# EAGLE design circuit_protection (EAGLE 6.5.0)
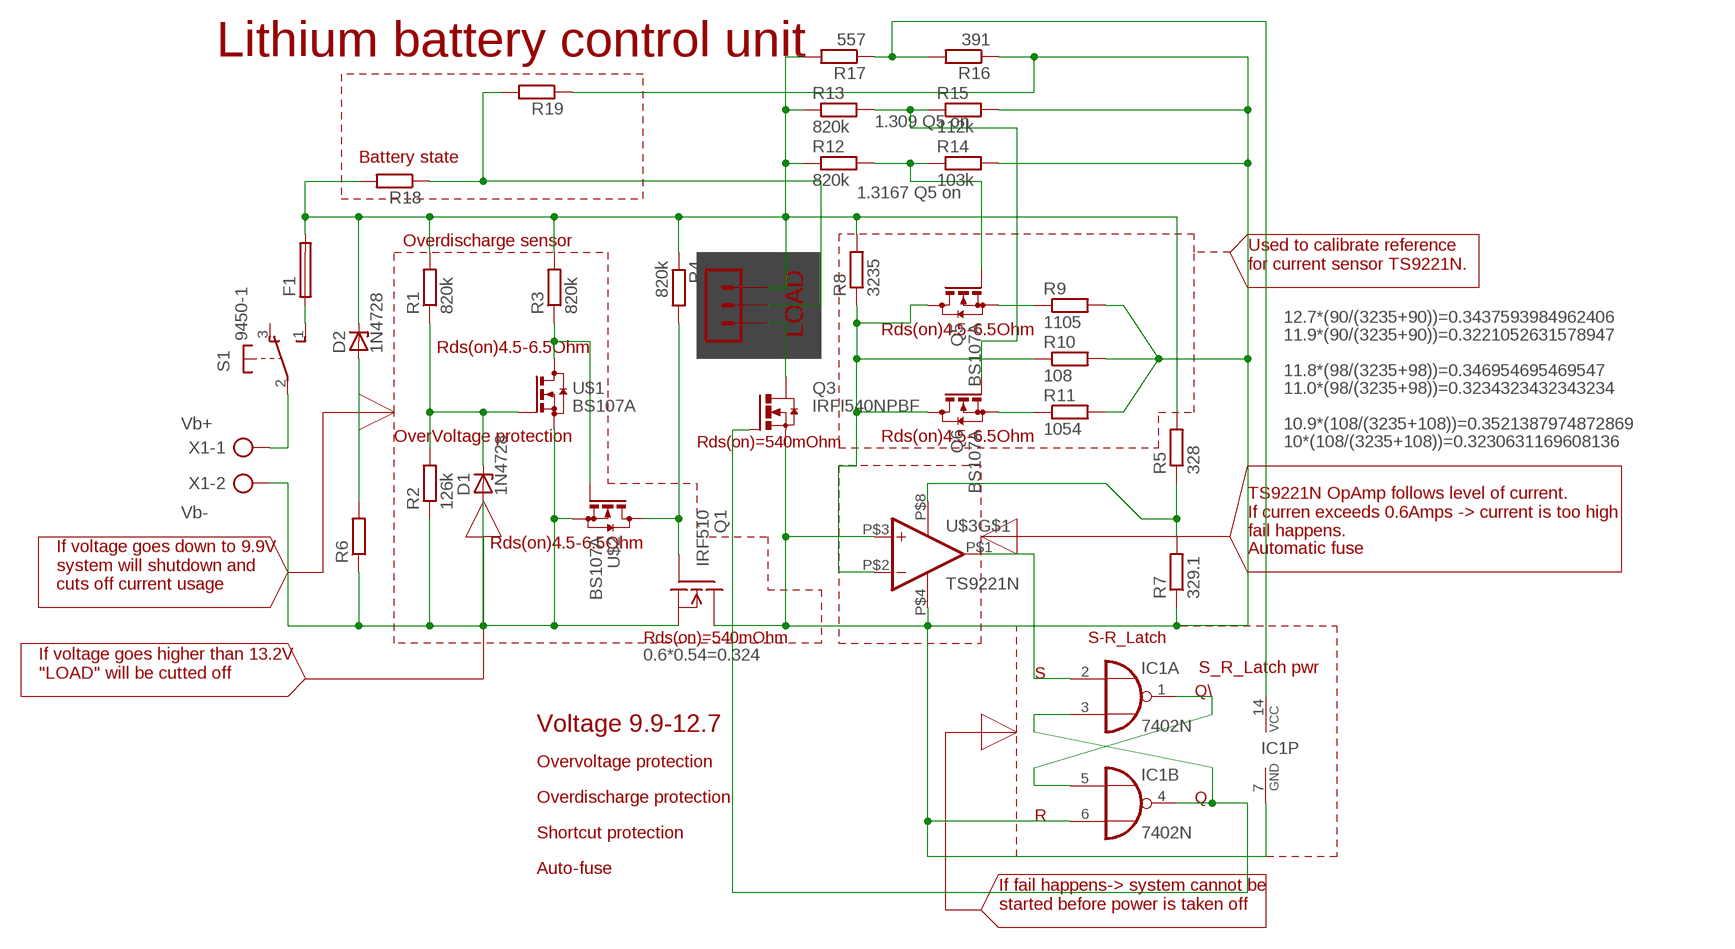
[diagram p0: schematic, sheet 1]

## Parts
D1  1N4728  [DO41Z10]
D2  1N4728  [DO41Z10]
F1  GSH15  [GSH15]
IC1  7402N  [DIL14]
Q1  IRF510  [TO220]
Q3  IRFI540NPBF  [TO220BH]
Q5  BS107A  [BC877]
Q6  BS107A  [BC877]
R1  820k  R-EU_0204/7  [0204/7]
R2  126k  R-EU_0204/7  [0204/7]
R3  820k  R-EU_0204/7  [0204/7]
R4  820k  R-EU_0204/7  [0204/7]
R5  328  R-EU_0204/7  [0204/7]
R6  R-EU_0204/7  [0204/7]
R7  329.1  R-EU_0204/7  [0204/7]
R8  3235  R-EU_0204/7  [0204/7]
R9  1105  R-EU_0204/7  [0204/7]
R10  108  R-EU_0204/7  [0204/7]
R11  1054  R-EU_0204/7  [0204/7]
R12  820k  R-EU_0204/7  [0204/7]
R13  820k  R-EU_0204/7  [0204/7]
R14  103k  R-EU_0204/7  [0204/7]
R15  112k  R-EU_0204/7  [0204/7]
R16  391  R-EU_0204/7  [0204/7]
R17  557  R-EU_0204/7  [0204/7]
R18  R-EU_0204/7  [0204/7]
R19  R-EU_0204/7  [0204/7]
S1  9450-1  [9450-1]
SV1  MA03-1  [MA03-1]
U$1  BS107A  [BC877]
U$2  BS107A  [BC877]
U$3  TS9221N  [DIP08]
X1  AK300/2  [AK300/2]

## Nets
820K: D1.C R1.1 R2.2 U$1.2(G)
BSTATE: R18.1 R19.2 SV1.2
GND: D1.A Q1.3(S) R2.1 R6.1 U$1.3(S) U$2.3(S) X1.2
GND2: IC1.6(B:I1) IC1.7(P:GND) Q1.2(D) Q3.S R7.1 R9.2 R10.2 R11.2 R14.2 R15.2 R16.1 R19.1 U$3.P$3(+IN) U$3.P$4(V-)
GND3: Q3.D SV1.1
N$2: D2.A R6.2
N$5: F1.1 S1.1(S)
N$6: IC1.3(A:I1) IC1.4(B:O) Q3.G
N$7: R3.1 U$1.1(D) U$2.2(G)
N$10: IC1.1(A:O) IC1.5(B:I0)
N$13: IC1.2(A:I0) U$3.P$1(OUT)
N$14: Q5.3(S) R9.1
N$16: Q5.2(G) R12.2 R14.1
N$17: Q6.2(G) R13.2 R15.1
N$19: Q5.1(D) Q6.1(D) R8.1 R10.1 U$3.P$2(-IN)
N$20: Q6.3(S) R11.1
OA-VCC+: R5.1 R7.2 U$3.P$8(V+)
QG: Q1.1(G) R4.2 U$2.1(D)
S-R_LATCH+: IC1.14(P:VCC) R16.2 R17.1
VB+: S1.2(P) X1.1
VCC: D2.C F1.2 R1.2 R3.2 R4.1 R5.2 R8.2 R12.1 R13.1 R17.2 R18.2 SV1.3
Unconnected: IC1.8(C:I0) IC1.9(C:I1) IC1.10(C:O) IC1.11(D:I0) IC1.12(D:I1) IC1.13(D:O) S1.3(O) U$3.P$5(+IN) U$3.P$6(-IN) U$3.P$7(OUT)

## Notes on the sheet
- Lithium battery control unit
- 1.309 Q5 on
- Battery state
- 1.3167 Q5 on
- Overdischarge sensor
- LOAD
- Used to calibrate reference
  for current sensor TS9221N.
- Rds(on)4.5-6.5Ohm | 12.7*(90/(3235+90))=0.3437593984962406
- Rds(on)4.5-6.5Ohm | 11.9*(90/(3235+90))=0.3221052631578947
- 11.8*(98/(3235+98))=0.346954695469547
- 11.0*(98/(3235+98))=0.3234323432343234
- Vb+ | OverVoltage protection | Rds(on)4.5-6.5Ohm | 10.9*(108/(3235+108))=0.3521387974872869
- Rds(on)=540mOhm | 10*(108/(3235+108))=0.3230631169608136
- Vb-
- Rds(on)4.5-6.5Ohm
- TS9221N OpAmp follows level of current.
  If curren exceeds 0.6Amps -> current is too high
  fail happens.
- Automatic fuse
- If voltage goes down to 9.9V
  system will shutdown and
  cuts off current usage
- Rds(on)=540mOhm | S-R_Latch
- 0.6*0.54=0.324 | S_R_Latch pwr
- If voltage goes higher than 13.2V
  "LOAD" will be cutted off
- S
- Q\
- Voltage 9.9-12.7
- Overvoltage protection
- Overdischarge protection | Q
- R
- Shortcut protection
- Auto-fuse
- If fail happens-> system cannot be
  started before power is taken off

## Library data of the parts
D1 D2 = diode:1N4728: Z DIODE 3.3 V, 1W, 5 percent
F1 = fuse:GSH15: FUSE HOLDER grid 15mm, 19649 Wickmann; MPN: 64900001039; OC_FARNELL: 1271673; OC_NEWARK: 02P0318
IC1 = 74xx-eu:74*02: Quad 2-input NOR gate
Q1 = transistor-fet:IRF510: N-Channel Enhancement MOSFET (HEXFET); 100V; 5,6A; 0,54Ohm
Q3 = transistor-power:IRFI540NPBF: HEXFET Power MOISFET VDSS = 100V, RDS(on) = 0.052 Ohm, ID = 20A, VGS(th) = 2.0 -- 4.0V Source: http://www.irf.com/product-info/datasheets/data/irfi540npbf.pdf
Q5 Q6 U$1 U$2 = transistor-small-signal:BS107A
R1 R2 R5 R7-R15 = rcl:R-EU_: RESISTOR, European symbol
R3 R4 R6 R16-R19 = resistor:R-EU_: RESISTOR, European symbol
S1 = switch-misc:9450-1: MARQUARDT SWITCH
SV1 = con-lstb:MA03-1: PIN HEADER; OC_FARNELL: unknown; OC_NEWARK: unknown
U$3 = linear:TS9221N
X1 = con-ptr500:AK300/2: CONNECTOR; OC_FARNELL: unknown; OC_NEWARK: unknown

## Board
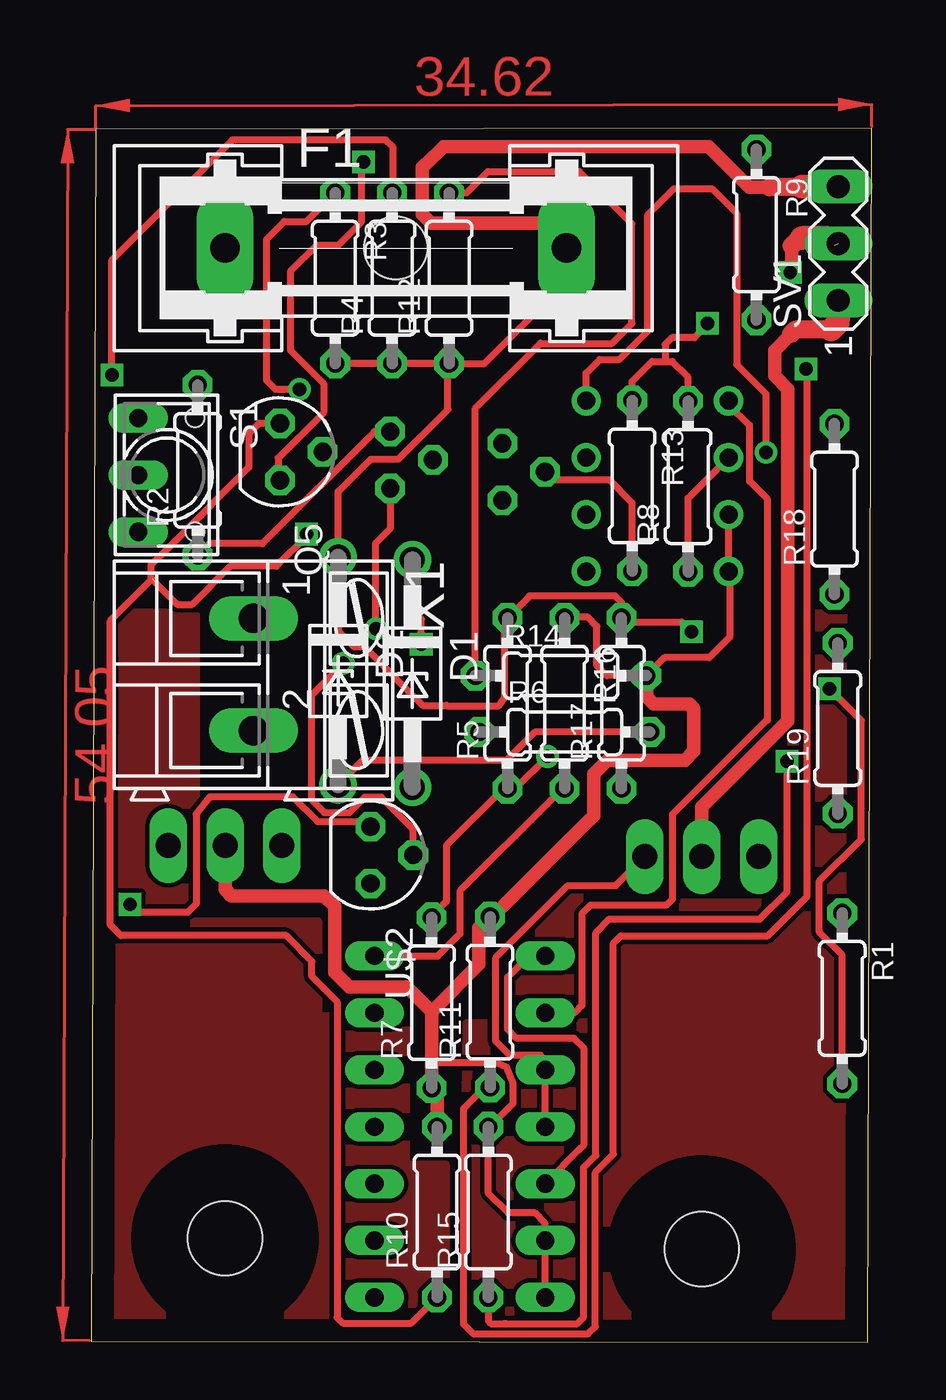
[diagram p1: board, top side]
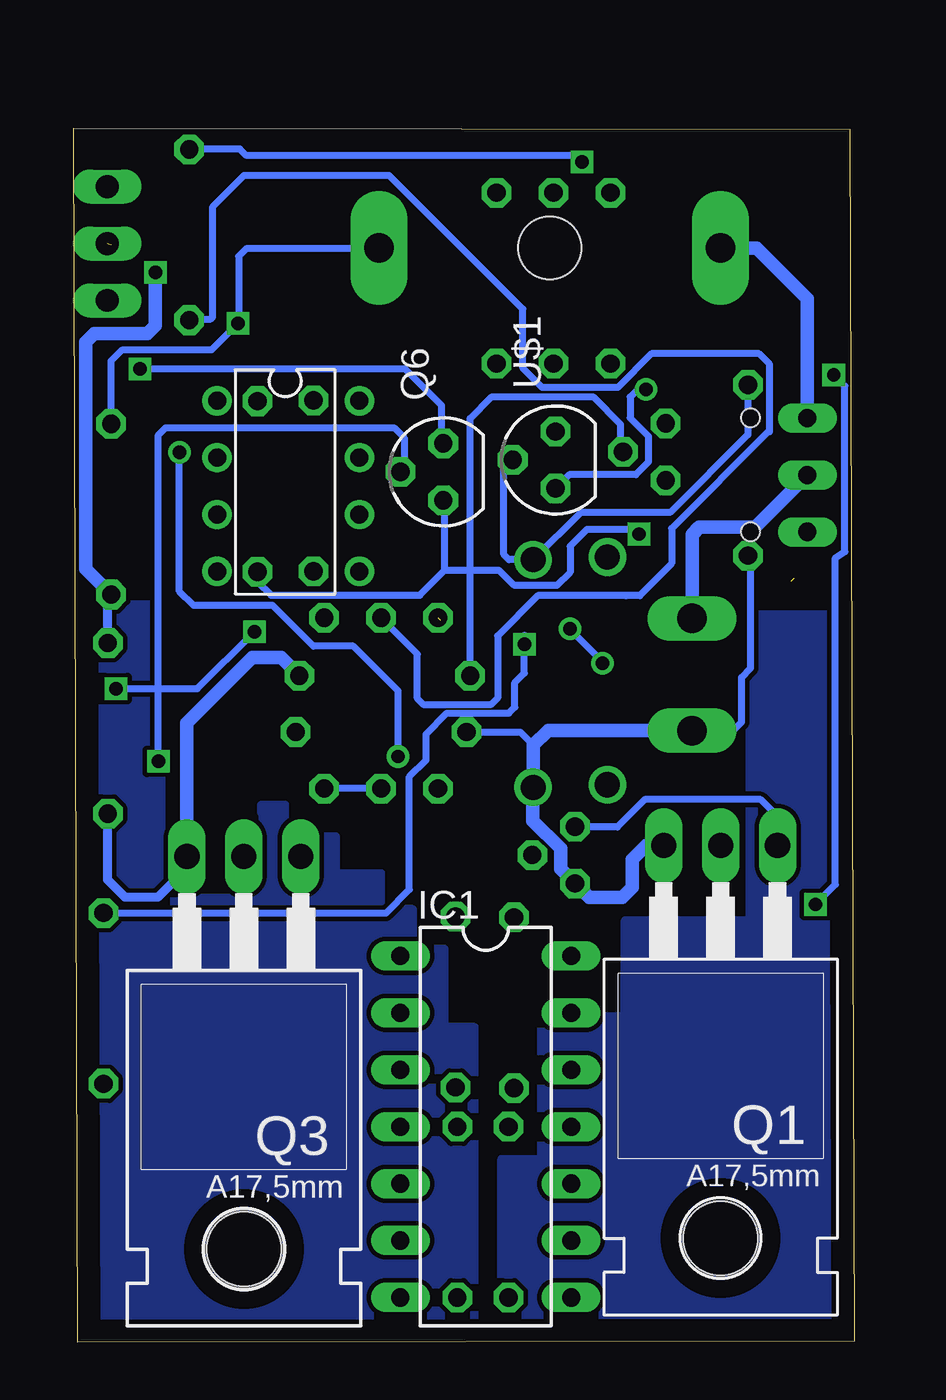
[diagram p2: board, bottom side, seen from below]

Size 34.83 x 54.18 mm. Coordinates in mm from the lower left corner, seen from the top.
Outline: 0,0.04 34.66,0 34.83,54.18 0.21,54.14 0,0.04
Copper layers (1*16): Top 0.035mm / dielectric 1.5mm / Bottom 0.035mm
Design rules "default": minimum track width 10mil, minimum drill 24mil, track to track 8mil, track to pad 8mil, pad to pad 8mil, via to via 8mil, smd to smd 8mil, copper to edge 40mil, drill to drill 8mil, minimum pad ring 10mil, minimum via ring 8mil, stop-mask expansion 4mil, vias tented up to drill 0mil, thermal gap 10mil

### Footprints (pad centres in the part's own frame; a part is rotated, then mirrored left to right if it is on the bottom)
DO41Z10 = drill 1.118: A 5.08,0; C -5.08,0
GSH15 = drill 1.321 pad 2.54 long: 1 -7.62,0; 2 7.62,0 | hole 2.794: 0,0
DIL14 = drill 0.813 long: 1 -7.62,-3.81; 2 -5.08,-3.81; 3 -2.54,-3.81; 4 0,-3.81; 5 2.54,-3.81; 6 5.08,-3.81; 7 7.62,-3.81; 8 7.62,3.81; 9 5.08,3.81; 10 2.54,3.81; 11 0,3.81; 12 -2.54,3.81; 13 -5.08,3.81; 14 -7.62,3.81
TO220 = drill 1.118 long: 1 -2.54,-6.35; 2 0,-6.35; 3 2.54,-6.35 | hole 3.302: 0,11.176
TO220BH = drill 1.118 long: D 0,-6.35; G -2.54,-6.35; S 2.54,-6.35 | hole 3.302: 0,11.176
BC877 = drill 0.813 octagon: 1 -1.27,0; 2 0,1.905; 3 1.27,0
0204/7 = drill 0.813 octagon: 1 -3.81,0; 2 3.81,0
9450-1 = drill 0.813 long: 1 -2.54,-1.27; 2 0,-1.27; 3 2.54,-1.27 | hole 0.813: 2.54,1.27; -2.54,1.27
MA03-1 = drill 1.016 long: 1 -2.54,0; 2 0,0; 3 2.54,0
DIP08 = drill 0.8: P$1 -7.62,-2.54; P$2 -5.08,-2.54; P$3 -2.54,-2.54; P$4 0,-2.54; P$5 0,3.81; P$6 -2.54,3.81; P$7 -5.08,3.81; P$8 -7.62,3.81
AK300/2 = drill 1.321 long: 1 -2.515,0; 2 2.489,0

### Placement (x,y rotation side)
D1  14.33,29.84 270 top
D2  11.02,29.96 270 top
F1  13.59,48.83 0 top
IC1  16.45,9.61 270 bottom
Q1  5.97,15.81 180 bottom
Q3  27.24,15.32 180 bottom
Q5  8.42,39.73 270 top
Q6  18.34,38.84 90 bottom
R1  33.51,15.34 270 top
R2  4.75,38.91 90 top
R3  10.89,47.48 270 top
R4  13.43,47.48 90 top
R5  18.58,28.51 90 top
R6  21.12,27.23 0 top
R7  15.19,15.15 90 top
R8  26.63,38.19 90 top
R9  29.68,49.42 270 top
R10  15.43,5.8 90 top
R11  17.8,15.17 90 top
R12  15.97,47.48 90 top
R13  24.14,38.22 270 top
R14  20.96,29.74 0 top
R15  17.72,5.8 90 top
R16  21.12,28.51 270 top
R17  23.66,28.51 90 top
R18  33.16,37.17 90 top
R19  33.31,27.39 90 top
S1  3.37,38.7 270 top
SV1  33.34,49.03 90 top
U$1  13.34,39.37 90 bottom
U$2  12.47,21.74 270 top
U$3  25.9,34.39 270 bottom
X1  7.24,29.78 270 top

### Tracks (layer width: path | path; a pad name or v marks a point on that pad's centre or on a via)
820K  (via drill 0.6)
  Top 0.305: v14.73,31.14 14.73,32.27 14.34,32.79 14.34,34.7 D1.C
  Bottom 0.305: R2.2 4.75,40.5 8.22,37.03 12.22,37.03 D1.C 15.41,34.92 15.64,35.15 15.64,38.97 U$1.2 | R1.1 20.9,19.15 19.85,20.19 19.85,25.24 19.11,25.98 19.11,27.13 18.18,28.07 15.42,28.07 15.15,28.34 15.15,29.44 14.73,29.86 14.73,31.55 v14.73,31.14
BSTATE  (via drill 0.6)  (1 unrouted)
  Top 0.61: 31.25,48.93 31.25,47.81 v31.19,47.75
  Top 0.813: 31.68,49.27 31.58,49.27 31.25,48.93
  Top 1.016: 33.16,48.85 33.16,48.95 32.92,49.19 32.92,49.25 32.88,49.29 31.7,49.29 31.68,49.27
  Bottom 0.406: R19.2 33.31,33.32 R18.1
  Bottom 0.61: v31.19,47.75 31.2,45.37 31.55,45.01 33.91,45.01 34.29,44.63 34.29,34.5 R18.1
GND
  Top 0.305: U$1.3 12.64,40.64 7.64,35.64 5.29,35.64 R2.1
  Bottom 0.305: 14.32,24.77 D1.A | R2.1 4.63,34.98 4.63,30.08 5.04,29.67 5.04,27.67 5.41,27.29 X1.2 | R6.1 14.91,27.23 14.32,26.64
  Bottom 0.61: X1.2 13.67,27.29 14.32,26.64 14.32,24.77 | D1.A 14.35,23.27 13.1,22.03 13.09,21.13 12.47,20.5 U$2.3 11.84,19.84 10.37,19.84 9.91,20.29 9.91,21.55 9.3,22.16 Q1.3
GND2
  Top 0.305: IC1.7 IC1.6 20.26,5.31 19.81,5.76 18.6,5.76 17.72,6.64 R15.2 17.79,9.61 18.82,10.65 18.82,11.53 18.53,12.27 18.1,12.46 15.27,12.46 15.19,12.39 | R16.1 21.15,32.36 22.15,32.36 22.56,31.95 22.56,30.19 23.01,29.74 R14.2 25.57,30.55 27.57,30.55 28.5,31.47 28.5,34.33 U$3.P$4 U$3.P$3 | R11.2 17.9,18.98
  Top 0.61: R10.2 15.43,11.1 R7.1 15.19,12.39 15.19,14.75 | 15.19,14.75 17.29,16.85 17.29,18.48 R11.2 | Q1.2 5.97,20.2 6.25,19.92 10.38,19.92 10.87,19.43 10.87,16.5 11.5,15.86 14.07,15.86 15.19,14.75 | 17.9,18.98 22.19,23.27 22.21,23.27 22.28,23.35 | 22.28,23.35 | 22.28,23.35 22.41,23.48 22.41,25.35 23.03,25.97 26.48,25.97 26.89,26.38 26.89,28.26 26.67,28.48 25.1,28.48 24.8,28.79 24.8,29.71 R14.2
  Bottom 0.305: 24.8,29.71 R14.2 | R16.1 19.49,30.7 19.49,28.72 19.21,28.44 16.23,28.44 15.92,28.74 15.92,31.52 14.14,33.31 10.21,33.31 10.17,33.31 9.57,33.31 8.16,34.75 8.16,36.32 3.85,40.63 3.79,40.63 3.79,43.64 4.25,44.11 9.06,44.11 10.56,42.61 13.93,42.61 14.79,43.47 14.79,46.1 20.76,52.07 27.24,52.07 28.65,50.65 28.65,47.24 28.64,47.2 28.64,45.74 28.74,45.64 29.66,45.64 R9.2
  Bottom 0.406: Q3.S 29.78,21.16 31.09,19.85 32.54,19.85 33.32,20.63 33.32,22.77 R19.1
  Bottom 0.61: Q3.S 29.79,26.35 29.79,27.63 26.88,30.55 25.57,30.55 R14.2
GND3
  Top 0.61: Q3.D 27.23,23.89 31.09,27.72 31.09,40.05 31.09,40.43 31.09,42.54 30.49,43.13 30.49,44.26 31.22,44.99
  Top 0.813: 33.01,45.18 31.41,45.18 31.22,44.99
  Top 1.016: SV1.1 33.34,45.67 33.32,45.65 33.32,45.48 33.01,45.18
N$2
  Top 0.305: R6.2 19.8,27.23 18.52,25.95 12.09,25.95 D2.A 11.08,24.94
N$5
  Bottom 0.305: F1.1
  Bottom 0.61: S1.1 2.1,46.57 4.36,48.82 F1.1
N$6
  Top 0.305: IC1.4 IC1.3 20.26,12.58 20.04,12.8 18.67,12.8 18.05,13.42 18.05,17.17 19.16,18.28 21.26,20.38 23.41,20.38 Q3.G
N$7  (via drill 0.6)
  Top 0.305: U$2.2 14.37,22.89 12.95,24.31 12.2,24.31 11.53,23.63 10.4,23.63 9.84,24.2 9.84,28.88 v11.25,30.29 | v12.7,31.83 12.7,35.67 13.36,36.33 13.36,38.08 U$1.1 | v9.29,42.52 8.22,42.52 7.83,42.91 7.83,49.22 8.61,50.01 9.6,50.01 R3.1
  Bottom 0.305: U$1.1 12.72,38.72 9.75,38.72 9.19,39.28 9.19,40.43 10.01,41.25 10.01,42.18 9.68,42.52 v9.29,42.52 | v11.25,30.29 11.25,30.37 v12.7,31.83
N$10
  Top 0.305: IC1.1 19.53,17.23 18.58,16.28 18.58,13.96 18.98,13.56 21.54,13.56 22,13.1 22,8.81 21.79,8.6 IC1.5
N$13
  Top 0.305: U$3.P$1 28.44,41.83 29.37,40.93 29.38,40.92 29.38,38.42 30.18,37.62 30.18,27.76 30.14,27.76 25.93,23.55 25.93,19.76 25.67,19.49 22.27,19.49 21.9,19.12 21.9,15.03 21.56,14.69 IC1.2
N$14  (via drill 0.6)
  Top 0.305: Q5.3 8.34,38.55 8.34,39.46 10.37,41.49 10.37,42.78 8.89,44.26 8.89,47.8 10.06,48.96 11.03,48.96 12.07,50 12.07,52.58 v12.15,52.67
  Bottom 0.305: R9.1 27.42,53.24 27.13,52.96 12.41,52.96 12.15,52.7 v12.15,52.67
N$16
  Top 0.305: R12.2 16.44,51.29 16.75,51.29 17.7,52.25 21.78,52.25 24.12,49.91 24.12,45.46 23.23,44.57 20.07,44.57 20.05,44.59 17.15,41.68 R14.1
  Bottom 0.305: R14.1 17.15,41.22 16.18,42.19 11.66,42.19 10.44,40.96 10.44,39.84 Q5.2
N$17  (via drill 0.6)
  Top 0.305: Q6.2 20.63,38.46 23.13,38.46 24.14,37.46 R13.2 24.16,34.41 | R15.1 17.72,0.95 17.83,0.82 18.42,0.82 18.5,0.82 21.69,0.82 21.97,1.11 21.97,7.79 22.51,8.33 22.51,18.27 23.12,18.88 29.83,18.88 31.05,20.1 v31.05,25.92
  Bottom 0.305: v31.05,25.92 31.05,40.49 30.73,40.81 20.53,40.81 20.09,40.37 20.09,39 Q6.2
N$19  (via drill 0.6)  (1 unrouted)
  Top 0.305: 15.75,1.99 R10.1 14.28,0.84 11.23,0.84 10.98,1.09 10.98,15.19 9.85,16.32 9.85,16.99 8.69,18.14 1.32,18.14 0.86,18.61 0.86,32.21 2.72,34.07 2.66,34.13 2.66,34.68 3.04,35.06 3.05,35.06 3.74,35.76 | R8.1 26.63,37.67 U$3.P$2 | v9.61,36.06 9.61,35.98 8.26,34.63 6.21,34.63 4.51,32.93 3.84,32.93 2.84,33.92 2.84,33.94 | Q5.1 7.48,41 7.03,40.55 7.03,39.05 3.74,35.76 | 3.74,35.76
  Bottom 0.305: R8.1 26.63,33.94 26.02,33.33 19.39,33.33 18.27,34.46 | 18.27,34.46 18.27,37.5 Q6.1 | v9.61,36.06 9.81,36.27 11.93,36.27 12.69,35.52 12.69,34.35 13.26,33.78 13.28,33.8 15.21,33.8 15.87,34.46 18.27,34.46
N$20  (via drill 0.6)
  Top 0.305: R11.1 17.55,11.36 16.6,10.42 16.6,0.81 17.05,0.36 22.16,0.36 22.49,0.69 22.49,7.57 23.3,8.38 23.3,17.8 23.63,18.13 30.18,18.13 31.94,19.89 31.94,43.39 v31.88,43.45
  Bottom 0.305: v31.88,43.45 20.06,43.45 18.43,41.81 18.43,40.2 Q6.3
OA-VCC+  (via drill 0.6)
  Top 0.305: v20.36,26.14 18.93,24.7 R5.1 18.4,24.7 15.85,22.16 15.85,19.66 v15.19,18.99 | v30.12,39.72 30.12,42.31 28.8,43.63 28.8,50.38 27.71,51.48 25.99,51.48 24.84,50.32 24.84,45.12 23.57,43.85 22.68,43.85 22.09,43.25 U$3.P$8
  Bottom 0.305: R7.2 v15.19,18.99 | 18.63,24.65 R5.1 | v20.36,26.14 20.36,29.07 22.35,31.06 24.14,31.06 25.96,32.88 29.48,32.88 30.12,33.51 v30.12,39.72
Q2T
  pour Bottom: 34.79,0.02 16.96,0.02 16.96,14.04 18.31,14.04 18.31,17.53 19.72,17.53 19.72,19.3 21.13,19.3 21.13,20.9 23.15,20.9 23.15,22.55 25.41,22.55 25.41,23.96 26.46,23.96 26.46,23.65 26.39,23.65 26.39,19.79 30.93,19.79 30.93,32.89 34.54,32.89 34.54,0.14
Q2T2
  pour Top: 34.49,0.35 16.6,0.35 16.78,14.22 18.37,14.22 18.37,17.53 19.78,17.53 19.78,19.37 21.19,19.37 21.19,20.77 23.27,20.77 26.39,19.61 31.05,19.61 31.05,32.83 34.54,32.83 34.51,0.62
QG  (via drill 0.6)
  Top 0.305: v1.74,19.53 2.09,19.18 4.31,19.18 4.69,19.55 4.69,23.56 5.3,24.33 8.99,24.33 10.1,23.23 12.25,23.23 U$2.1 | v0.92,43.17 0.92,48.28 6.29,53.65 13.14,53.65 13.47,53.32 13.47,51.34 R4.2
  Bottom 0.305: Q1.1 3.43,23.46 4.18,24.21 9.36,24.21 10.58,22.99 12.45,22.99 U$2.1 | v1.74,19.53 | v1.74,19.53 0.85,20.43 0.85,35 0.42,35.28 0.42,42.67 v0.92,43.17
QT
  pour Bottom: 15.73,0.88 15.73,8.16 13.96,8.16 13.96,14.53 10.22,14.53 10.22,18.82 4.65,18.82 4.65,26.16 4.65,32.47 0.11,32.47 0.11,32.59 -0.07,32.59 -0.07,0.02 15.61,0.02 15.61,1
QT2
  pour Top: 15.67,-0.04 -0.07,-0.04 -0.07,32.53 4.58,32.53 4.58,32.47 4.65,32.47 4.65,18.75 10.1,18.75 10.1,14.53 14.02,14.53 14.02,7.92 15.8,7.92 15.8,0.02
S-R_LATCH+
  Top 0.305: R16.2 21.03,24.7 20.52,24.2 16.45,20.13 16.45,18.21 15.47,17.23 IC1.14
  Bottom 0.305: R16.2 R17.1
VB+
  Bottom 0.305: 2.12,38.68 S1.2
  Bottom 0.61: X1.1 7.24,36.05 6.92,36.37 4.43,36.37 S1.2
VCC  (via drill 0.6)  (1 unrouted)
  Top 0.305: 18.45,32.2 18.45,28.76 18.18,28.4 15.88,28.4 15.85,28.42 14.8,28.42 12.19,31.04 11.72,31.04 11.02,31.74 D2.C 11.02,37.96 12.47,39.41 13.7,39.41 15.92,41.63 15.92,43.62 R12.1 | R5.2 19.56,33.31 23.37,33.31 23.66,33.02 R17.2 23.84,32.14 26.33,32.14 v26.78,31.7 | R1.2 33.51,17.28 32.49,18.29 32.49,20.57 34.36,22.44 34.36,27.74 v32.94,29.16 | R13.1 24.14,42.88 25.02,43.76 25.61,43.76 | 25.61,43.76 25.93,43.76 26.63,43.06 R8.2 | 27.5,45.42 26.91,44.83 25.9,44.83 25.61,44.53 25.61,43.76 | R12.1 R4.1 R3.2 | R12.1 17.54,43.67 21.2,47.33 21.2,48.82 F1.2
  Top 0.61: 30.27,51.54 29.36,51.54 27.54,53.36 15.73,53.36 14.91,52.54 14.89,52.54 14.78,52.43 14.78,50.34 15.18,49.94 20.11,49.94 F1.2 | v27.5,45.48 27.5,45.42
  Top 0.813: 31.68,51.55 30.28,51.55 30.27,51.54
  Top 1.016: SV1.3 31.7,51.57 31.68,51.55
  Bottom 0.305: F1.2 27.11,48.82 27.47,48.46 27.47,45.51 | v32.94,29.16 29.31,29.16 v26.78,31.7 | R18.2 33.16,43.8 32.66,44.29 28.68,44.29 v27.5,45.48
  Bottom 0.61: 27.47,45.51 v27.5,45.48
(copper drawn outside any net)
  shapes: Top area x2